# EAGLE design eb-1 (EAGLE 7.7.0)

## Sheet 1 of 2
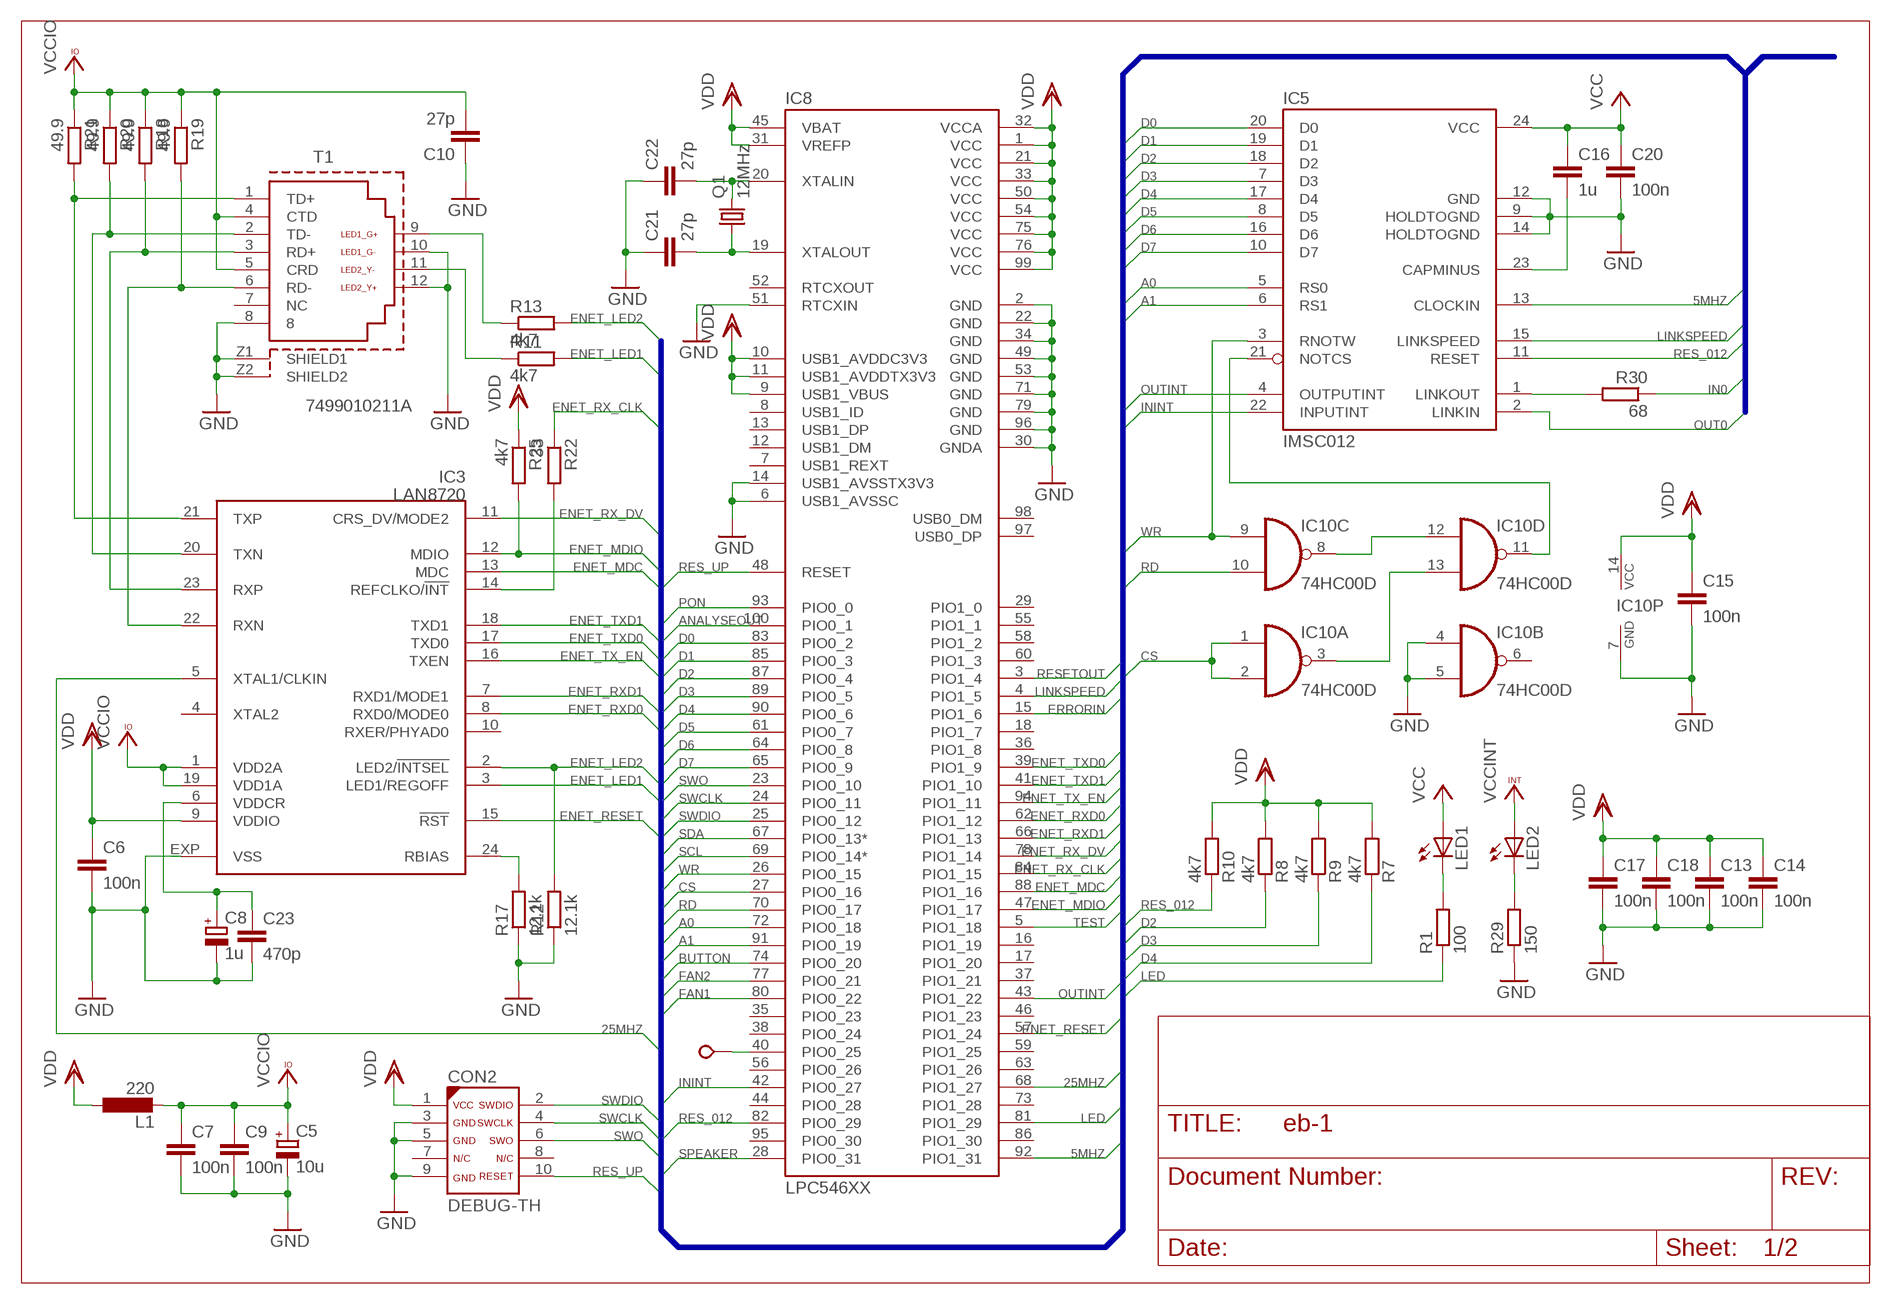
[diagram p0: schematic, sheet 1]

### Parts
C5  10u  CPOL-EUCT3216  [CT3216]
C6  100n  C-EUC1206  [C1206]
C7  100n  C-EUC1206  [C1206]
C8  1u  CPOL-EUCT3216  [CT3216]
C9  100n  C-EUC1206  [C1206]
C10  27p  C-EUC1206  [C1206]
C13  100n  C-EUC1206  [C1206]
C14  100n  C-EUC1206  [C1206]
C15  100n  C-EUC1206  [C1206]
C16  1u  C-EUC1206  [C1206]
C17  100n  C-EUC1206  [C1206]
C18  100n  C-EUC1206  [C1206]
C20  100n  C-EUC1206  [C1206]
C21  27p  C-EUC1206  [C1206]
C22  27p  C-EUC1206  [C1206]
C23  470p  C-EUC1206  [C1206]
CON2  DEBUG-TH  [DEBUG-TH]
IC3  LAN8720  [QFN24]
IC5  IMSC012  [DIL24-3]
IC8  LPC546XX  [LQFP100]
IC10  74HC00D  [SO14]
L1  220  L-EUL3216C  [L3216C]
LED1  LEDSMT1206  [1206]
LED2  LEDSMT1206  [1206]
Q1  12MHz  CRYSTALHC49UP  [HC49UP]
R1  100  R-EU_R1206  [R1206]
R7  4k7  R-EU_R1206  [R1206]
R8  4k7  R-EU_R1206  [R1206]
R9  4k7  R-EU_R1206  [R1206]
R10  4k7  R-EU_R1206  [R1206]
R11  4k7  R-EU_R1206  [R1206]
R12  12.1k  R-EU_R1206  [R1206]
R13  4k7  R-EU_R1206  [R1206]
R17  12.1k  R-EU_R1206  [R1206]
R18  49.9  R-EU_R1206  [R1206]
R19  49.9  R-EU_R1206  [R1206]
R20  49.9  R-EU_R1206  [R1206]
R21  49.9  R-EU_R1206  [R1206]
R22  33  R-EU_R1206  [R1206]
R25  4k7  R-EU_R1206  [R1206]
R29  150  R-EU_R1206  [R1206]
R30  68  R-EU_R1206  [R1206]
T1  7499010211A  WE-RJ45_7499010211A  [7499010211A]
TP2  TESTPOINT  [VERO_TP]

### Nets
5MHZ: IC5.13(CLOCKIN) IC8.92(PIO1_31)
25MHZ: IC3.5(XTAL1/CLKIN) IC8.68(PIO1_27)
A0: IC5.5(RS0) IC8.72(PIO0_18)
A1: IC5.6(RS1) IC8.91(PIO0_19)
ANALYSEOUT: IC8.100(PIO0_1) ; also sheet 2
BUTTON: IC8.74(PIO0_20) ; also sheet 2
CS: IC8.27(PIO0_16) IC10.1(A:I0) IC10.2(A:I1)
D0: IC5.20(D0) IC8.83(PIO0_2)
D1: IC5.19(D1) IC8.85(PIO0_3)
D2: IC5.18(D2) IC8.87(PIO0_4) R8.1
D3: IC5.7(D3) IC8.89(PIO0_5) R9.1
D4: IC5.17(D4) IC8.90(PIO0_6) R7.1
D5: IC5.8(D5) IC8.61(PIO0_7)
D6: IC5.16(D6) IC8.64(PIO0_8)
D7: IC5.10(D7) IC8.65(PIO0_9)
ENET_LED1: IC3.3(LED1/REGOFF) R11.2
ENET_LED2: IC3.2(LED2/!INTSEL) R12.2 R13.2
ENET_MDC: IC3.13(MDC) IC8.88(PIO1_16)
ENET_MDIO: IC3.12(MDIO) IC8.47(PIO1_17) R25.2
ENET_RESET: IC3.15(!RST) IC8.57(PIO1_24)
ENET_RX_CLK: IC8.84(PIO1_15) R22.1
ENET_RX_DV: IC3.11(CRS_DV/MODE2) IC8.78(PIO1_14)
ENET_RXD0: IC3.8(RXD0/MODE0) IC8.62(PIO1_12)
ENET_RXD1: IC3.7(RXD1/MODE1) IC8.66(PIO1_13)
ENET_TX_EN: IC3.16(TXEN) IC8.94(PIO1_11)
ENET_TXD0: IC3.17(TXD0) IC8.39(PIO1_9)
ENET_TXD1: IC3.18(TXD1) IC8.41(PIO1_10)
ERRORIN: IC8.15(PIO1_6) ; also sheet 2
FAN1: IC8.80(PIO0_22) ; also sheet 2
FAN2: IC8.77(PIO0_21) ; also sheet 2
GND: C5.- C6.2 C7.2 C8.- C9.2 C10.1 C13.2 C14.2 C15.2 C17.2 C18.2 C20.2 C21.1 C22.1 C23.2 CON2.3 CON2.5 CON2.9 IC3.EXP(VSS) IC5.9(HOLDTOGND) IC5.12(GND) IC5.14(HOLDTOGND) IC8.2(GND) IC8.6(USB1_AVSSC) IC8.14(USB1_AVSSTX3V3) IC8.22(GND) IC8.30(GNDA) IC8.34(GND) IC8.49(GND) IC8.51(RTCXIN) IC8.53(GND) IC8.71(GND) IC8.79(GND) IC8.96(GND) IC10.4(B:I0) IC10.5(B:I1) IC10.7(P:GND) R12.1 R17.1 R29.1 T1.8 T1.10(LED1_G-) T1.12(LED2_Y+) T1.Z1(SHIELD1) T1.Z2(SHIELD2) ; also sheet 2
IN0: R30.1 ; also sheet 2
ININT: IC5.22(INPUTINT) IC8.42(PIO0_27)
LED: IC8.81(PIO1_29) R1.1
LINKSPEED: IC5.15(LINKSPEED) IC8.4(PIO1_5) ; also sheet 2
N$1: IC3.14(REFCLKO/!INT) R22.2
N$6: R13.1 T1.9(LED1_G+)
N$7: IC3.24(RBIAS) R17.2
N$8: R11.1 T1.11(LED2_Y-)
N$9: IC8.40(PIO0_25) TP2.P$1
N$15: C8.+ C23.1 IC3.6(VDDCR)
N$35: C22.2 IC8.20(XTALIN) Q1.2
N$36: C21.2 IC8.19(XTALOUT) Q1.1
N$44: IC5.1(LINKOUT) R30.2
N$57: IC5.21(NOTCS) IC10.11(D:O)
N$60: C16.2 IC5.23(CAPMINUS)
N$63: LED2.C R29.2
N$65: LED1.C R1.2
N$66: IC10.8(C:O) IC10.12(D:I0)
N$68: IC10.3(A:O) IC10.13(D:I1)
OUT0: IC5.2(LINKIN) ; also sheet 2
OUTINT: IC5.4(OUTPUTINT) IC8.43(PIO1_22)
PON: IC8.93(PIO0_0) ; also sheet 2
RD: IC8.70(PIO0_17) IC10.10(C:I1)
RES_012: IC5.11(RESET) IC8.82(PIO0_29) R10.1
RES_UP: CON2.10 IC8.48(RESET)
RESETOUT: IC8.3(PIO1_4) ; also sheet 2
RX_N: IC3.22(RXN) R19.2 T1.6(RD-)
RX_P: IC3.23(RXP) R18.2 T1.3(RD+)
SCL: IC8.69(PIO0_14*) ; also sheet 2
SDA: IC8.67(PIO0_13*) ; also sheet 2
SPEAKER: IC8.28(PIO0_31) ; also sheet 2
SWCLK: CON2.4 IC8.24(PIO0_11)
SWDIO: CON2.2 IC8.25(PIO0_12)
SWO: CON2.6 IC8.23(PIO0_10)
TEST: IC8.5(PIO1_18) ; also sheet 2
TX_N: IC3.20(TXN) R20.2 T1.2(TD-)
TX_P: IC3.21(TXP) R21.2 T1.1(TD+)
VCC: C16.1 C20.1 IC5.24(VCC) LED1.A ; also sheet 2
VCCINT: LED2.A ; also sheet 2
VCCIO: C5.+ C7.1 C9.1 C10.2 IC3.1(VDD2A) IC3.19(VDD1A) L1.2 R18.1 R19.1 R20.1 R21.1 T1.4(CTD) T1.5(CRD)
VDD: C6.1 C13.1 C14.1 C15.1 C17.1 C18.1 CON2.1 IC3.9(VDDIO) IC8.1(VCC) IC8.9(USB1_VBUS) IC8.10(USB1_AVDDC3V3) IC8.11(USB1_AVDDTX3V3) IC8.21(VCC) IC8.31(VREFP) IC8.32(VCCA) IC8.33(VCC) IC8.45(VBAT) IC8.50(VCC) IC8.54(VCC) IC8.75(VCC) IC8.76(VCC) IC8.99(VCC) IC10.14(P:VCC) L1.1 R7.2 R8.2 R9.2 R10.2 R25.1 ; also sheet 2
WR: IC5.3(RNOTW) IC8.26(PIO0_15) IC10.9(C:I0)
Unconnected: CON2.7 CON2.8 IC3.4(XTAL2) IC3.10(RXER/PHYAD0) IC8.7(USB1_REXT) IC8.8(USB1_ID) IC8.12(USB1_DM) IC8.13(USB1_DP) IC8.16(PIO1_19) IC8.17(PIO1_20) IC8.18(PIO1_7) IC8.29(PIO1_0) IC8.35(PIO0_23) IC8.36(PIO1_8) IC8.37(PIO1_21) IC8.38(PIO0_24) IC8.44(PIO0_28) IC8.46(PIO1_23) IC8.52(RTCXOUT) IC8.55(PIO1_1) IC8.56(PIO0_26) IC8.58(PIO1_2) IC8.59(PIO1_25) IC8.60(PIO1_3) IC8.63(PIO1_26) IC8.73(PIO1_28) IC8.86(PIO1_30) IC8.95(PIO0_30) IC8.97(USB0_DP) IC8.98(USB0_DM) IC10.6(B:O) T1.7(NC)

### Buses
IN[0..1],OUT[0..1],ERROROUT,ERRORIN,ANALYSEIN,ANALYSEOUT,RESETIN,RESETOUT,PON,LINKSPEED,TEST,FAN[1..2],VUSB,SPEAKER,SDA,SCL,BUTTON,LED,5MHZ,SWDIO,SWCLK,SWO,RES_UP,D[0..7],A[0..1],WR,RD,CS,OUTINT,ININT,RES_012

## Sheet 2 of 2
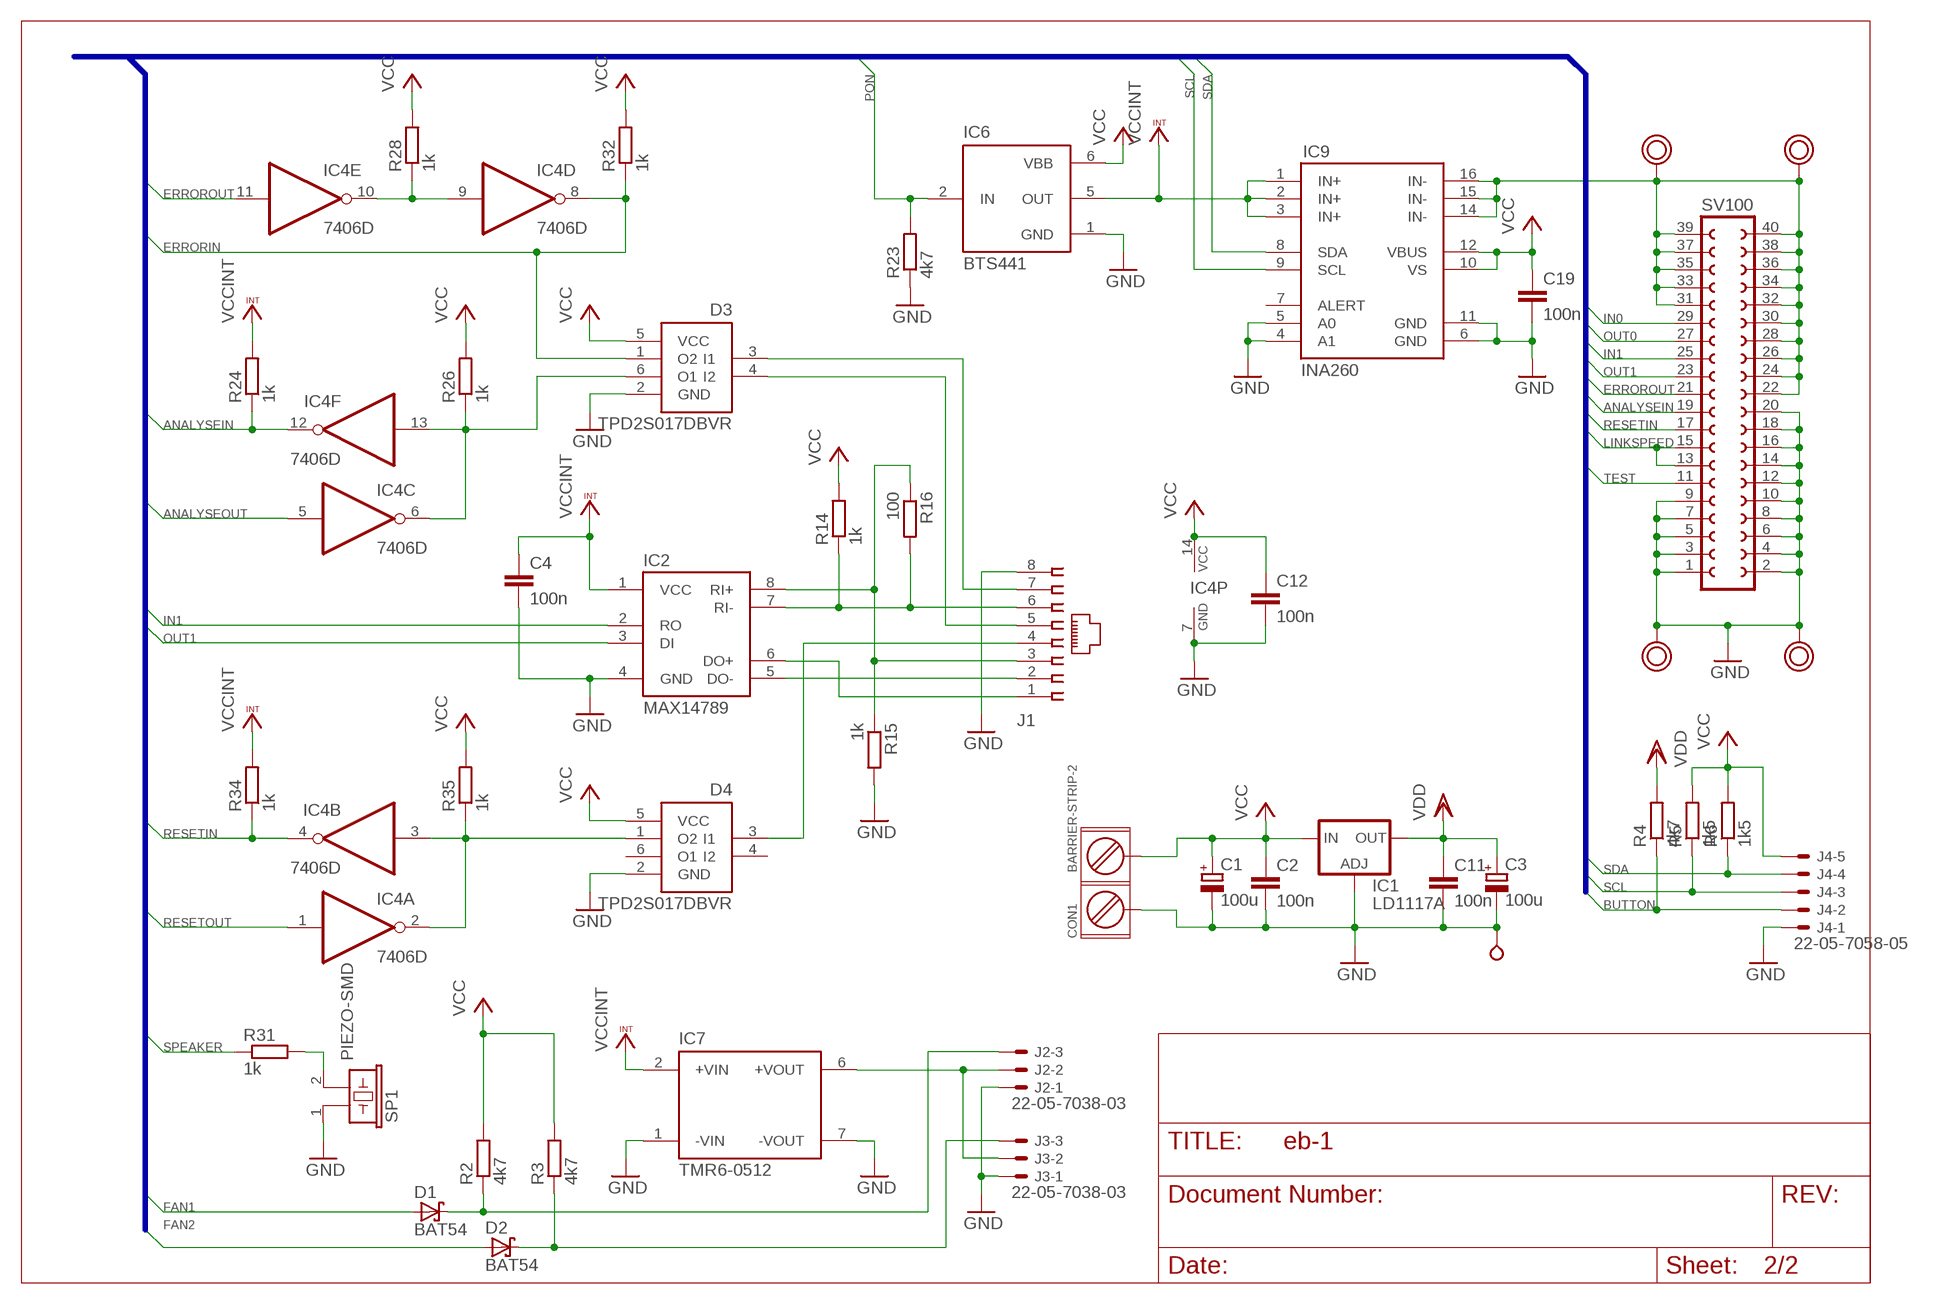
[diagram p1: schematic, sheet 2]

### Parts
C1  100u  CPOL-EUSMCB  [SMC_B]
C2  100n  C-EUC1206  [C1206]
C3  100u  CPOL-EUSMCB  [SMC_B]
C4  100n  C-EUC1206  [C1206]
C11  100n  C-EUC1206  [C1206]
C12  100n  C-EUC1206  [C1206]
C19  100n  C-EUC1206  [C1206]
CON1  BARRIER-STRIP-2  [BARRIER-STRIP-2]
D1  BAT54  [SOT23]
D2  BAT54  [SOT23]
D3  TPD2S017DBVR  [SOT23-6]
D4  TPD2S017DBVR  [SOT23-6]
IC1  LD1117A  [SOT223]
IC2  MAX14789  DS8921  [SO8]
IC4  7406D  [SO14]
IC6  BTS441  [TO263-4]
IC7  TMR6-0512  [TMR6-0512]
IC9  INA260  [TSSOP-16]
J1  555164-1  [555164-1]
J2  22-05-7038-03  [7395-03]
J3  22-05-7038-03  [7395-03]
J4  22-05-7058-05  [7395-05]
R2  4k7  R-EU_R1206  [R1206]
R3  4k7  R-EU_R1206  [R1206]
R4  4k7  R-EU_R1206  [R1206]
R5  1k5  R-EU_R1206  [R1206]
R6  1k5  R-EU_R1206  [R1206]
R14  1k  R-EU_R1206  [R1206]
R15  1k  R-EU_R1206  [R1206]
R16  100  R-EU_R1206  [R1206]
R23  4k7  R-EU_R1206  [R1206]
R24  1k  R-EU_R1206  [R1206]
R26  1k  R-EU_R1206  [R1206]
R28  1k  R-EU_R1206  [R1206]
R31  1k  R-EU_R1206  [R1206]
R32  1k  R-EU_R1206  [R1206]
R34  1k  R-EU_R1206  [R1206]
R35  1k  R-EU_R1206  [R1206]
SCREW1  POWERPAD  [POWERPAD]
SCREW2  POWERPAD  [POWERPAD]
SCREW3  POWERPAD  [POWERPAD]
SCREW4  POWERPAD  [POWERPAD]
SP1  PIEZO-SMD  [PIEZO-SMD]
SV100  FE20-2  [FE20-2]
TP1  TESTPOINT  [VERO_TP]

### Nets
ANALYSEIN: IC4.12(F:O) R24.1 SV100.19
ANALYSEOUT: IC4.5(C:I) ; also sheet 1
BUTTON: J4.2 R4.1 ; also sheet 1
ERRORIN: D3.1(O2) IC4.8(D:O) R32.1 ; also sheet 1
ERROROUT: IC4.11(E:I) SV100.21
FAN1: D1.1(A) ; also sheet 1
FAN2: D2.1(A) ; also sheet 1
GND: C1.- C2.2 C3.- C4.2 C11.2 C12.2 C19.2 CON1.1 D3.2(GND) D4.2(GND) IC1.1(ADJ) IC2.4(GND) IC4.7(P:GND) IC6.1(GND) IC7.1(-VIN) IC7.7(-VOUT) IC9.4(A1) IC9.5(A0) IC9.6(GND) IC9.11(GND) J1.8 J2.1 J3.1 J4.1 R15.2 R23.1 SCREW2.P$1 SCREW4.P$1 SP1.1 SV100.1 SV100.2 SV100.3 SV100.4 SV100.5 SV100.6 SV100.7 SV100.8 SV100.9 SV100.10 SV100.12 SV100.14 SV100.16 SV100.18 SV100.20 TP1.P$1 ; also sheet 1
IN0: SV100.29 ; also sheet 1
IN1: IC2.2(RO) SV100.25
LINKSPEED: SV100.13 SV100.15 ; also sheet 1
N$2: D4.1(O2) IC4.2(A:O) IC4.3(B:I) R35.1
N$3: IC4.9(D:I) IC4.10(E:O) R28.1
N$5: IC2.6(DO+) J1.1
N$10: IC2.5(DO-) J1.2
N$11: D3.3(I1) J1.7
N$12: D4.3(I1) J1.4
N$13: D3.4(I2) J1.5
N$14: D3.6(O1) IC4.6(C:O) IC4.13(F:I) R26.1
N$21: IC2.8(RI+) J1.3 R15.1 R16.1
N$22: IC2.7(RI-) J1.6 R14.1 R16.2
N$33: D2.3(C) J3.3 R3.1
N$40: IC9.14(IN-) IC9.15(IN-) IC9.16(IN-) SCREW1.P$1 SCREW3.P$1 SV100.22 SV100.24 SV100.26 SV100.28 SV100.30 SV100.31 SV100.32 SV100.33 SV100.34 SV100.35 SV100.36 SV100.37 SV100.38 SV100.39 SV100.40
N$59: D1.3(C) J2.3 R2.1
N$64: R31.2 SP1.2
N$67: IC7.6(+VOUT) J2.2 J3.2
OUT0: SV100.27 ; also sheet 1
OUT1: IC2.3(DI) SV100.23
PON: IC6.2(IN) R23.2 ; also sheet 1
RESETIN: IC4.4(B:O) R34.1 SV100.17
RESETOUT: IC4.1(A:I) ; also sheet 1
SCL: IC9.9(SCL) J4.4 R6.1 ; also sheet 1
SDA: IC9.8(SDA) J4.3 R5.1 ; also sheet 1
SPEAKER: R31.1 ; also sheet 1
TEST: SV100.11 ; also sheet 1
VCC: C1.+ C2.1 C12.1 C19.1 CON1.2 D3.5(VCC) D4.5(VCC) IC1.3(IN) IC4.14(P:VCC) IC6.6(VBB) IC9.10(VS) IC9.12(VBUS) J4.5 R2.2 R3.2 R5.2 R6.2 R14.2 R26.2 R28.2 R32.2 R35.2 ; also sheet 1
VCCINT: C4.1 IC2.1(VCC) IC6.5(OUT) IC7.2(+VIN) IC9.1(IN+) IC9.2(IN+) IC9.3(IN+) R24.2 R34.2 ; also sheet 1
VDD: C3.+ C11.1 IC1.2(OUT) R4.2 ; also sheet 1
Unconnected: D4.4(I2) D4.6(O1) IC9.7(ALERT)

### Buses
IN[0..1],OUT[0..1],ERROROUT,ERRORIN,ANALYSEIN,ANALYSEOUT,RESETIN,RESETOUT,PON,LINKSPEED,TEST,FAN[1..2],VUSB,SPEAKER,SDA,SCL,BUTTON,LED,5MHZ,SWDIO,SWCLK,SWO,RES_UP,D[0..7],A[0..1],WR,RD,CS,OUTINT,ININT,RES_012

## Library data of the parts
C1 C3 = rcl:CPOL-EU: POLARIZED CAPACITOR, European symbol; DIGIKEY: 478-5801-1-ND
C2 C4 C6 C7 C9-C15 C17-C23 = rcl:C-EU: CAPACITOR, European symbol; DIGIKEY: 478-10855-1-ND
C5 C8 = rcl:CPOL-EU: POLARIZED CAPACITOR, European symbol
C16 = rcl:C-EU: CAPACITOR, European symbol; DIGIKEY: 478-1567-1-ND
CON1 = Transputer:BARRIER-STRIP-2; DIGIKEY: WM13929-ND
CON2 = Transputer:DEBUG; DIGIKEY: 1175-1627-ND
D1 D2 = diode:BAT54: Schottky Diodes Source: Fairchild .. BAT54.pdf; DIGIKEY: BAT54FSCT-ND
D3 D4 = Transputer:TPD2S017DBVR
IC1 = Transputer:LD1117A; DIGIKEY: 497-1228-1-ND
IC2 = Transputer:DS8921; DIGIKEY: MAX14789EGSA+-ND
IC3 = microchip-smsc-lan8720:LAN8720: LAN8720A/LAN8720Ai Small Footprint RMII 10/100 Ethernet PHY Transceiver with HP Auto-MDIX Support from SMSC / Microchip <http://www.microchip.com>. (C) 2014 Tomasz Boleslaw CEDRO, cederom@tlen.pl, http://www.tomek.cedro.info. Version 0.1 (2014-01-04): Initial release.
IC4 = 74xx-eu:74*06: Hex INVERTER, open collector high-voltage output
IC5 = Transputer:IMSC012
IC6 = Transputer:BTS441; DIGIKEY: BTS441TGATMA1CT-ND
IC7 = Transputer:TMR6-0512; DIGIKEY: 1951-2391-ND
IC8 = Transputer:LPC546XX
IC9 = Transputer:INA260; DIGIKEY: 296-47777-1-ND
IC10 = 74xx-eu:74*00: Quad 2-input NAND gate
J1 = con-amp:555164-1: AMP connector; DIGIKEY: A31442-ND
J2 J3 = con-molex:22-?-03: CONNECTOR wire to board 2.54 mm (.1 inch) pitch header; DIGIKEY: WM2785-ND; OC_FARNELL: unknown; OC_NEWARK: unknown
J4 = con-molex:22-?-05: CONNECTOR wire to board 2.54 mm (.1 inch) pitch header; DIGIKEY: WM2787-ND; OC_FARNELL: unknown; OC_NEWARK: unknown
L1 = rcl:L-EU: INDUCTOR, European symbol
LED1 LED2 = led:LED: LED OSRAM: - CHIPLED LG R971, LG N971, LY N971, LG Q971, LY Q971, LO R971, LY R971 LH N974, LH R974 LS Q976, LO Q976, LY Q976 LO Q996 - Hyper CHIPLED LW Q18S LB Q993, LB Q99A, LB R99A - SideLED LS A670, LO A670, LY A670, LG A670, LP A670 LB A673, LV A673, LT A673, LW A673 LH A674 LY A675 LS A676, LA A676, LO A676, LY A676, LW A676 LS A679, LY A679, LG A679 - Hyper Micro SIDELED® LS Y876, LA Y876, LO Y876, LY Y876 LT Y87S - SmartLED LW L88C, LW L88S LB L89C, LB L89S, LG L890 LS L89K, LO L89K, LY L89K LS L896, LA L896, LO L896, LY L896 - TOPLED LS T670, LO T670, LY T670, LG T670, LP T670 LSG T670, LSP T670, LSY T670, LOP T670, LYG T670 LG T671, LOG T671, LSG T671 LB T673, LV T673, LT T673, LW T673 LH T674 LS T676, LA T676, LO T676, LY T676, LB T676, LH T676, LSB T676, LW T676 LB T67C, LV T67C, LT T67C, LS T67K, LO T67K, LY T67K, LW E67C LS E67B, LA E67B, LO E67B, LY E67B, LB E67C, LV E67C, LT E67C LW T67C LS T679, LY T679, LG T679 LS T770, LO T770, LY T770, LG T770, LP T770 LB T773, LV T773, LT T773, LW T773 LH T774 LS E675, LA E675, LY E675, LS T675 LS T776, LA T776, LO T776, LY T776, LB T776 LHGB T686 LT T68C, LB T68C - Hyper Mini TOPLED® LB M676 - Mini TOPLED Santana® LG M470 LS M47K, LO M47K, LY M47K Source: http://www.osram.convergy.de LUXEON: - LUMILED® LXK2-PW12-R00, LXK2-PW12-S00, LXK2-PW14-U00, LXK2-PW14-V00 LXK2-PM12-R00, LXK2-PM12-S00, LXK2-PM14-U00 LXK2-PE12-Q00, LXK2-PE12-R00, LXK2-PE12-S00, LXK2-PE14-T00, LXK2-PE14-U00 LXK2-PB12-K00, LXK2-PB12-L00, LXK2-PB12-M00, LXK2-PB14-N00, LXK2-PB14-P00, LXK2-PB14-Q00 LXK2-PR12-L00, LXK2-PR12-M00, LXK2-PR14-Q00, LXK2-PR14-R00 LXK2-PD12-Q00, LXK2-PD12-R00, LXK2-PD12-S00 LXK2-PH12-R00, LXK2-PH12-S00 LXK2-PL12-P00, LXK2-PL12-Q00, LXK2-PL12-R00 Source: www.luxeon.com KINGBRIGHT: KA-3528ASYC Source: www.kingbright.com; DIGIKEY: 160-1404-1-ND
Q1 = crystal:CRYSTAL: CRYSTAL; OC_FARNELL: unknown; OC_NEWARK: unknown
R1 R16 = rcl:R-EU_: RESISTOR, European symbol; DIGIKEY: CR1206-FX-1000ELFCT-ND
R2-R4 R7-R13 R17-R23 R25 = rcl:R-EU_: RESISTOR, European symbol; DIGIKEY: CR1206-FX-4701ELFCT-ND
R5 R6 = rcl:R-EU_: RESISTOR, European symbol; DIGIKEY: CR1206-FX-1501ELFCT-ND
R14 R15 R24 R26 R28 R31 R32 R34 R35 = rcl:R-EU_: RESISTOR, European symbol; DIGIKEY: CR1206-FX-1001ELFCT-ND
R29 = rcl:R-EU_: RESISTOR, European symbol; DIGIKEY: CR1206-FX-1500ELFCT-ND
R30 = rcl:R-EU_: RESISTOR, European symbol; DIGIKEY: CR1206-FX-68R0ELFCT-ND
SCREW1-SCREW4 = Transputer:POWERPAD
SP1 = Transputer:PIEZO-SMD; DIGIKEY: 490-9647-1-ND
SV100 = con-lsta:FE20-2: FEMALE HEADER; OC_FARNELL: unknown; OC_NEWARK: unknown
T1 = o160650v244+Eagle_WE-RJ45+(rev20e):WE-RJ45_7499010211A: WE-RJ45 LAN Transformer Characteristics RJ45 Connector with integrated transformer / common mode choke Power over Ethernet up to 50 Watt and speeds up to 10 Gbit/s Available in SMD, THT and THT with USB Compliant with standards: IEEE 802.3u, IEEE 802.3ab, IEEE 802.3af, IEEE 802.3at, IEEE 802.3an and upcoming IEE 802.3bt Applications Suitable for industrial temperatures from –40 °C up to +85 °C Compatible to Industrial Ethernet systems like EtherCAT or Profinet Compliant with most IC’s for Ethernet applications such as Microchip, Texas Instruments, Broadcom, Linear Technology Hubs, Routers, Switches, IP cameras, IoT applications <https://www.we-online.com/catalog/media/o35731v209%20Family_WE-RJ45-LAN.jpg> Details see: https://www.we-online.com/catalog/en/WE-LAN-RJ45 Updated by Ella Wu 2019-08-05 2019 (C) Wurth Elektronik; DATA-RATE: 10/100 Base-T; DATASHEET-URL: https://www.we-online.com/catalog/datasheet/7499010211A.pdf; LED: green-yellow; MOUNT: THT; PART-NUMBER: 7499010211A; POE: non-PoE; PORTS: 1; USB: No
TP1 TP2 = Transputer:TESTPOINT

## Board
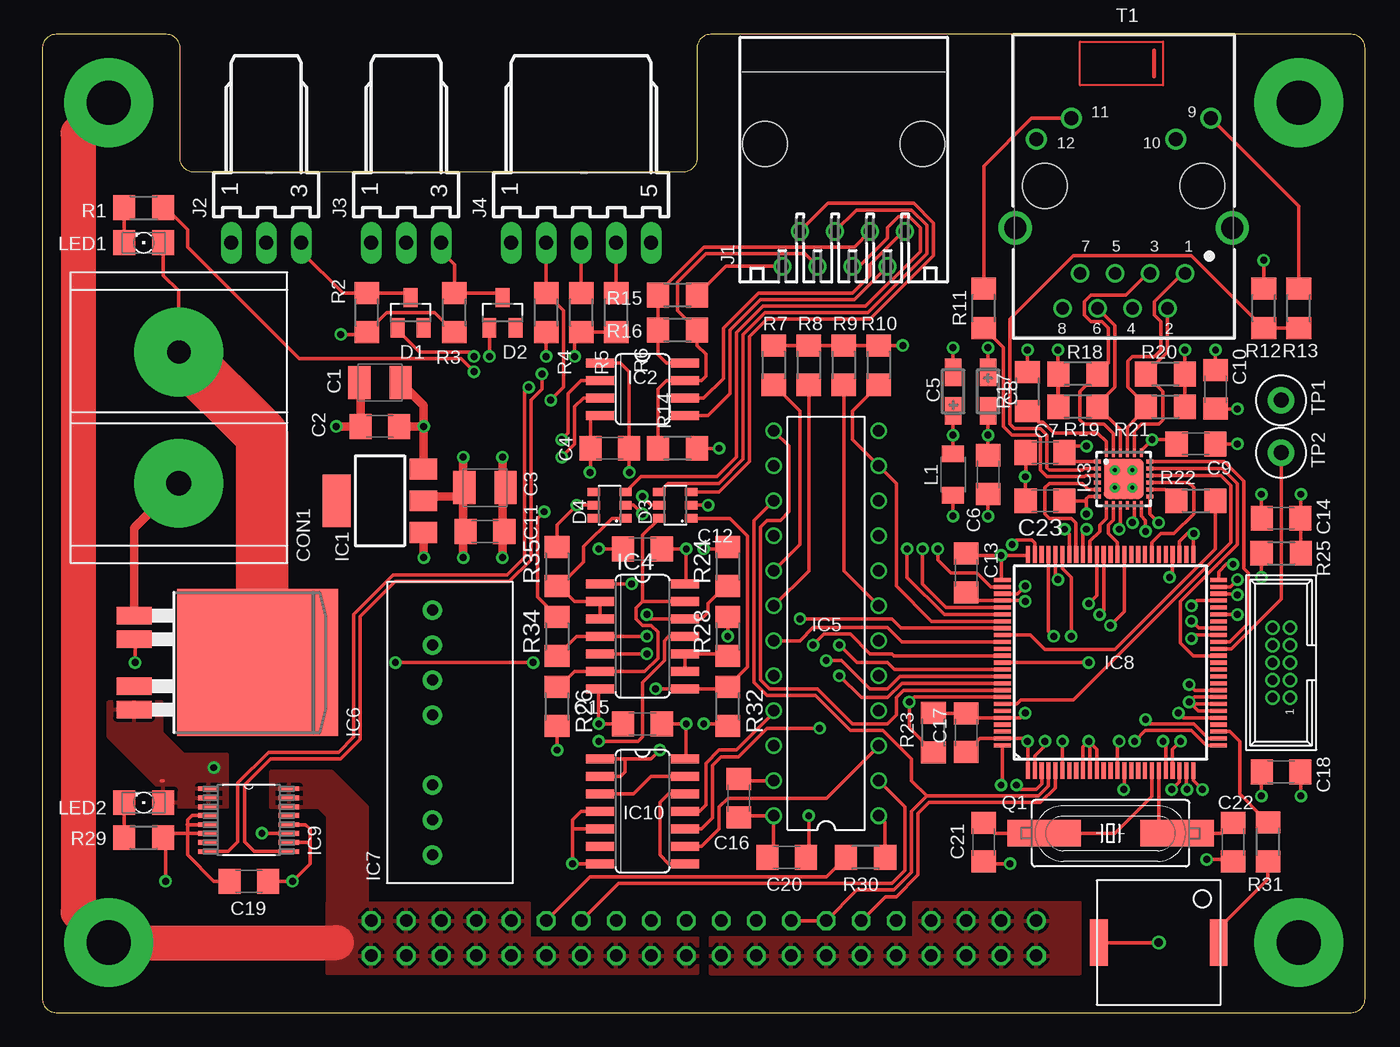
[diagram p2: board, top side]
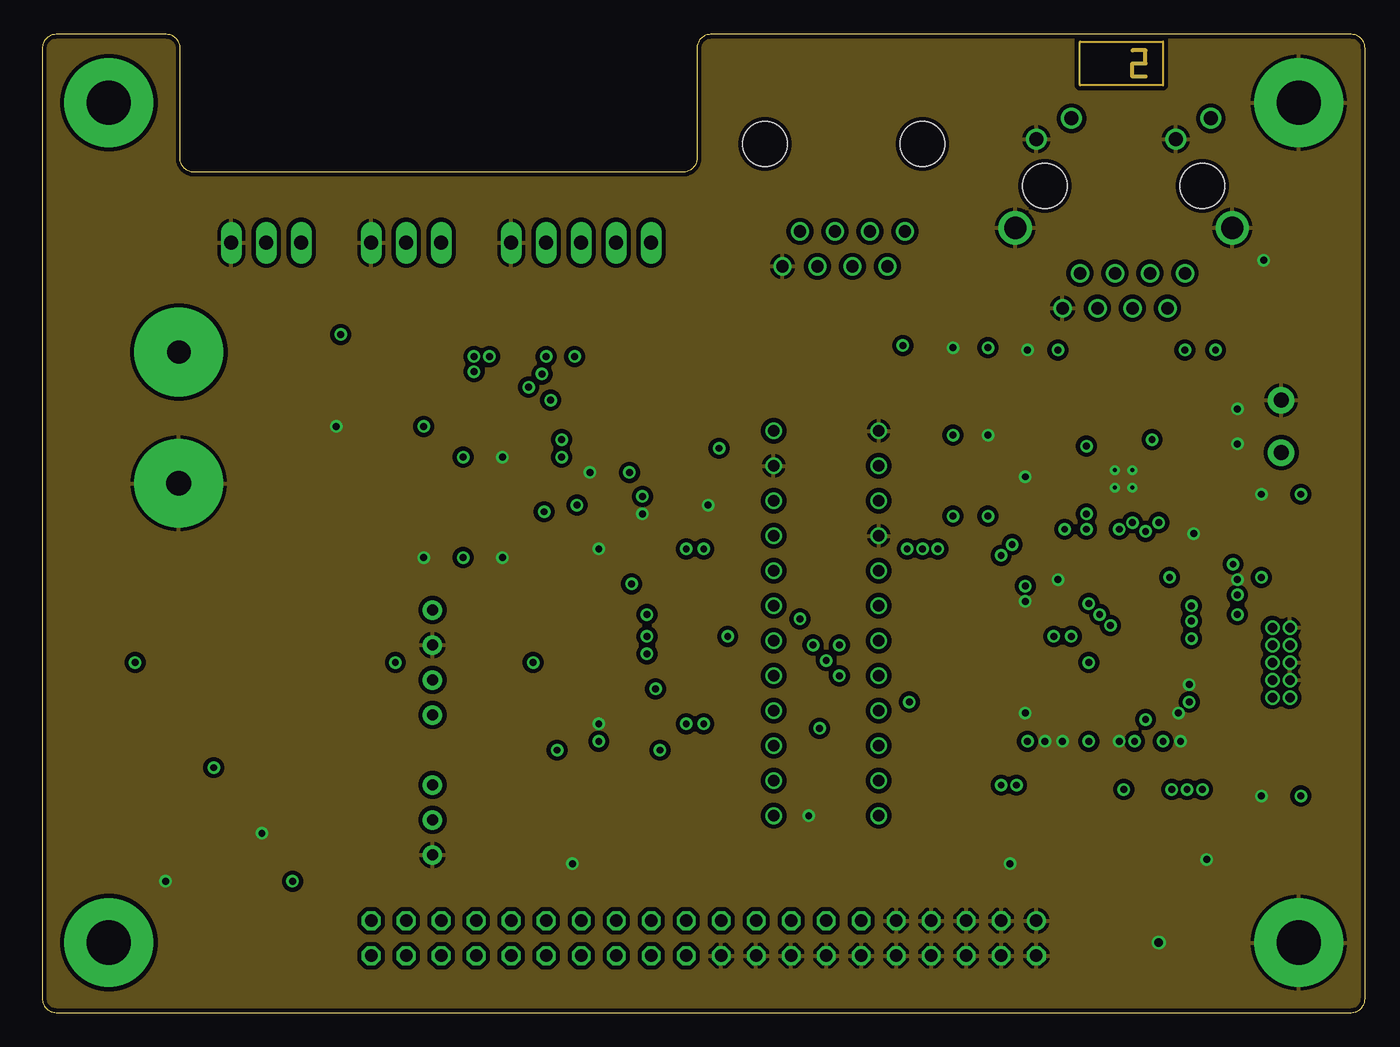
[diagram p3: board, inner layer Route2]
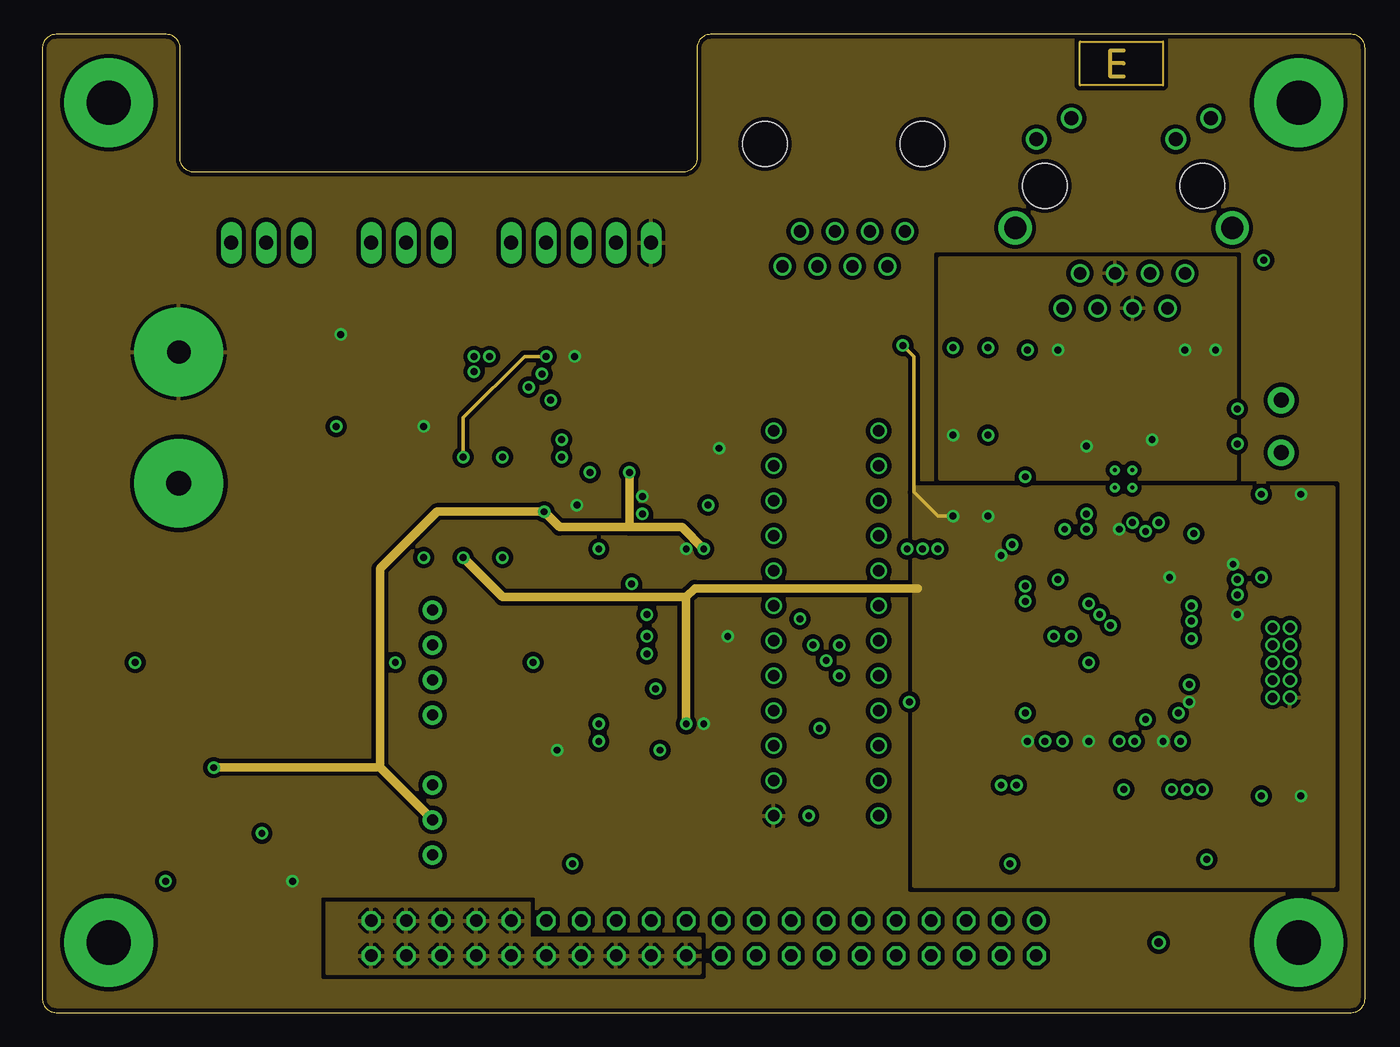
[diagram p4: board, inner layer Route15]
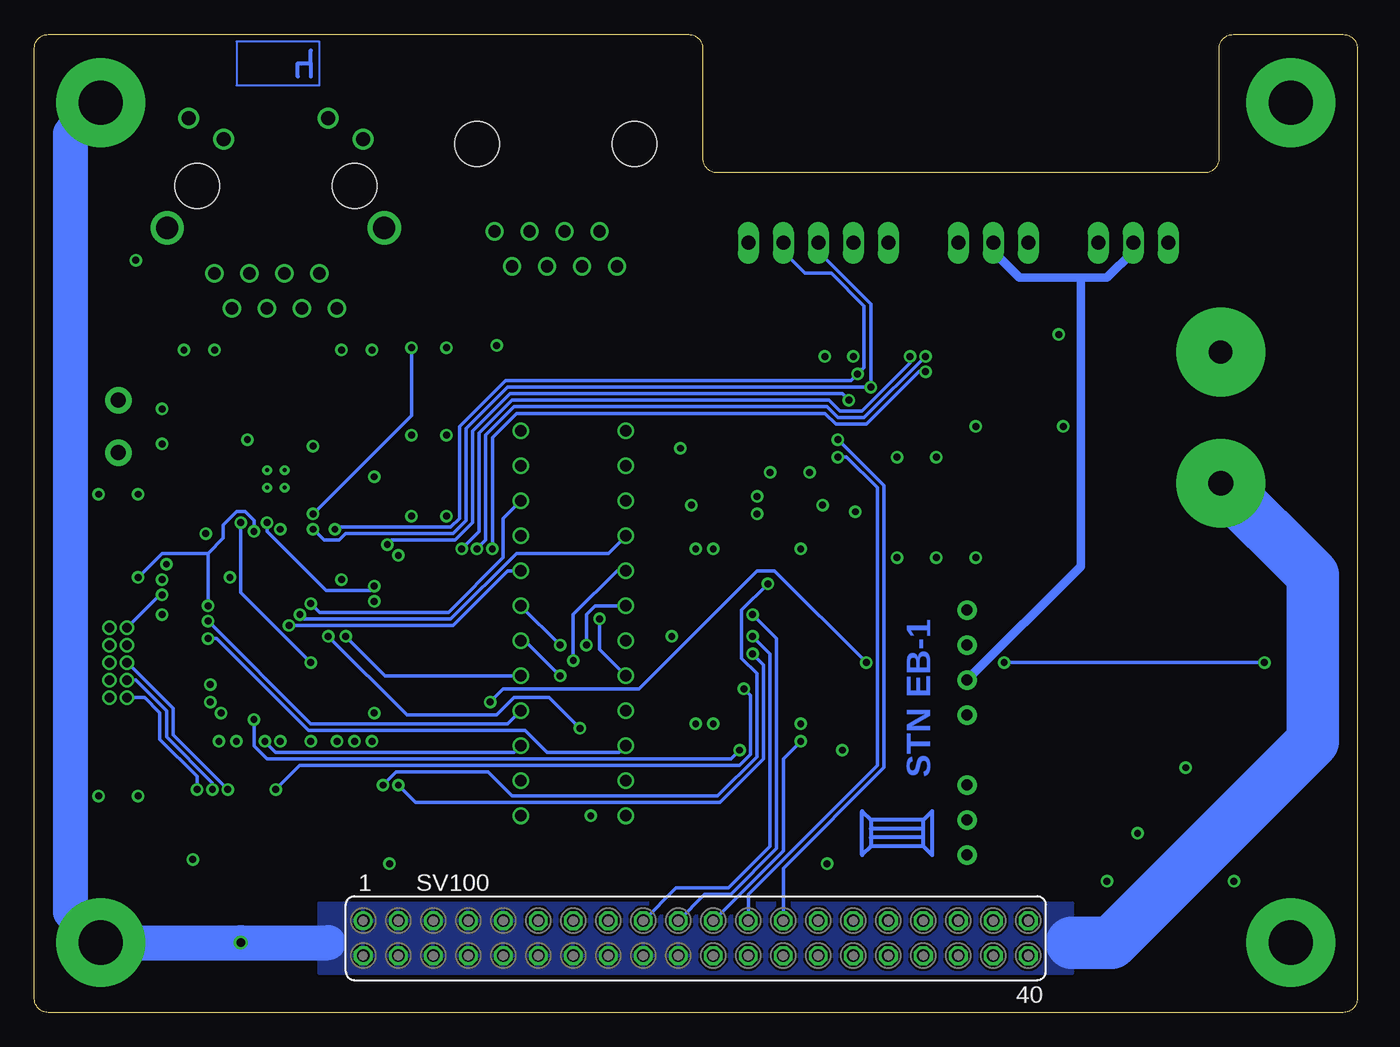
[diagram p5: board, bottom side, seen from below]

Size 96 x 71 mm. Coordinates in mm from the lower left corner, seen from the top.
Outline: 1,0 95,0 arc90 96,1 96,70 arc90 95,71 48.5,71 arc90 47.5,70 47.5,62 arc-90 46.5,61 11,61 arc-90 10,62 10,70 arc90 9,71 1,71 arc90 0,70 0,1 arc90 1,0
Copper layers (1*2*3*14*15*16): Top 0.035mm / dielectric 1.5mm / Route2 0.035mm / dielectric 0.15mm / Route3 0.035mm / dielectric 0.2mm / Route14 0.035mm / dielectric 0.15mm / Route15 0.035mm / dielectric 0.2mm / Bottom 0.035mm
Design rules "wedirect *": minimum track width 0.1mm, minimum drill 16mil, track to track 0.1mm, track to pad 0.1mm, pad to pad 0.1mm, via to via 0.1mm, smd to smd 0.1mm, copper to edge 0.25mm, drill to drill 8mil, minimum pad ring 0.1mm, minimum via ring 8mil, stop-mask expansion 4mil, vias tented up to drill 0mil, thermal gap 10mil

### Footprints (pad centres in the part's own frame; a part is rotated, then mirrored left to right if it is on the bottom)
SMC_B = smd 1.6 x 2.4: + -1.5,0; - 1.5,0
C1206 = smd 1.6 x 1.8: 1 -1.4,0; 2 1.4,0
CT3216 = smd 2 x 1.2: + -1.4,0; - 1.4,0
BARRIER-STRIP-2 = drill 1.8 pad 6.452: 1 -4.763,0 | drill 1.7 pad 6.452: 2 4.763,0
DEBUG-TH = drill 0.7 pad 1.016: 1 -2.54,-0.635; 2 -2.54,0.635; 3 -1.27,-0.635; 4 -1.27,0.635; 5 0,-0.635; 6 0,0.635; 7 1.27,-0.635; 8 1.27,0.635; 9 2.54,-0.635; 10 2.54,0.635
SOT23 = smd 1 x 1.4: 1 -0.95,-1.1; 2 0.95,-1.1; 3 0,1.1
SOT23-6 = smd 0.6 x 0.9: 1 -0.95,-1.15; 2 0,-1.15; 3 0.95,-1.15; 4 0.95,1.15; 5 0,1.15; 6 -0.95,1.15
SOT223 = smd 1.5 x 2: 1 -2.3,-3.15; 2 0,-3.15; 3 2.3,-3.15 | smd 3.8 x 2: 4 0,3.15
SO8 = smd 0.66 x 2.032: 1 -1.905,-3.073; 2 -0.635,-3.073; 3 0.635,-3.073; 4 1.905,-3.073; 5 1.905,3.073; 6 0.635,3.073; 7 -0.635,3.073; 8 -1.905,3.073
QFN24 = smd 0.6 x 0.3: 1 -1.905,1.27; 2 -1.905,0.762; 3 -1.905,0.254; 4 -1.905,-0.254; 5 -1.905,-0.762; 6 -1.905,-1.27; 13 1.905,-1.27; 14 1.905,-0.762; 15 1.905,-0.254; 16 1.905,0.254; 17 1.905,0.762; 18 1.905,1.27 | smd 0.3 x 0.6: 7 -1.27,-1.905; 8 -0.762,-1.905; 9 -0.254,-1.905; 10 0.254,-1.905; 11 0.762,-1.905; 12 1.27,-1.905; 19 1.27,1.905; 20 0.762,1.905; 21 0.254,1.905; 22 -0.254,1.905; 23 -0.762,1.905; 24 -1.27,1.905 | smd 2.9 x 2.9: EXP 0,0
SO14 = smd 0.66 x 2.032: 1 -3.81,-3.073; 2 -2.54,-3.073; 3 -1.27,-3.073; 4 0,-3.073; 5 1.27,-3.073; 6 2.54,-3.073; 7 3.81,-3.073; 8 3.81,3.073; 9 2.54,3.073; 10 1.27,3.073; 11 0,3.073; 12 -1.27,3.073; 13 -2.54,3.073; 14 -3.81,3.073
DIL24-3 = drill 0.813: 1 -12.7,-3.81; 2 -10.16,-3.81; 3 -7.62,-3.81; 4 -5.08,-3.81; 5 -2.54,-3.81; 6 0,-3.81; 7 2.54,-3.81; 8 5.08,-3.81; 9 7.62,-3.81; 10 10.16,-3.81; 11 12.7,-3.81; 12 15.24,-3.81; 13 15.24,3.81; 14 12.7,3.81; 15 10.16,3.81; 16 7.62,3.81; 17 5.08,3.81; 18 2.54,3.81; 19 0,3.81; 20 -2.54,3.81; 21 -5.08,3.81; 22 -7.62,3.81; 23 -10.16,3.81; 24 -12.7,3.81
TO263-4 = smd 1.27 x 2.54: 1 -3.404,-5.791; 2 -1.702,-5.791; 4 1.702,-5.791; 5 3.404,-5.791 | smd 10.668 x 11.684: 6 0,3.175
TMR6-0512 = drill 0.8 pad 1.422: 1 -8.89,0; 2 -6.35,0; 3 -3.81,0; 5 1.27,0; 6 3.81,0; 7 6.35,0; 8 8.89,0
LQFP100 = smd 1.2 x 0.3: 1 -7.85,6; 2 -7.85,5.5; 3 -7.85,5; 4 -7.85,4.5; 5 -7.85,4; 6 -7.85,3.5; 7 -7.85,3; 8 -7.85,2.5; 9 -7.85,2; 10 -7.85,1.5; 11 -7.85,1; 12 -7.85,0.5; 13 -7.85,0; 14 -7.85,-0.5; 15 -7.85,-1; 16 -7.85,-1.5; 17 -7.85,-2; 18 -7.85,-2.5; 19 -7.85,-3; 20 -7.85,-3.5; 21 -7.85,-4; 22 -7.85,-4.5; 23 -7.85,-5; 24 -7.85,-5.5; 25 -7.85,-6; 51 7.85,-6; 52 7.85,-5.5; 53 7.85,-5; 54 7.85,-4.5; 55 7.85,-4; 56 7.85,-3.5; 57 7.85,-3; 58 7.85,-2.5; 59 7.85,-2; 60 7.85,-1.5; 61 7.85,-1; 62 7.85,-0.5; 63 7.85,0; 64 7.85,0.5; 65 7.85,1; 66 7.85,1.5; 67 7.85,2; 68 7.85,2.5; 69 7.85,3; 70 7.85,3.5; 71 7.85,4; 72 7.85,4.5; 73 7.85,5; 74 7.85,5.5; 75 7.85,6 | smd 0.3 x 1.2: 26 -6,-7.85; 27 -5.5,-7.85; 28 -5,-7.85; 29 -4.5,-7.85; 30 -4,-7.85; 31 -3.5,-7.85; 32 -3,-7.85; 33 -2.5,-7.85; 34 -2,-7.85; 35 -1.5,-7.85; 36 -1,-7.85; 37 -0.5,-7.85; 38 0,-7.85; 39 0.5,-7.85; 40 1,-7.85; 41 1.5,-7.85; 42 2,-7.85; 43 2.5,-7.85; 44 3,-7.85; 45 3.5,-7.85; 46 4,-7.85; 47 4.5,-7.85; 48 5,-7.85; 49 5.5,-7.85; 50 6,-7.85; 76 6,7.85; 77 5.5,7.85; 78 5,7.85; 79 4.5,7.85; 80 4,7.85; 81 3.5,7.85; 82 3,7.85; 83 2.5,7.85; 84 2,7.85; 85 1.5,7.85; 86 1,7.85; 87 0.5,7.85; 88 0,7.85; 89 -0.5,7.85; 90 -1,7.85; 91 -1.5,7.85; 92 -2,7.85; 93 -2.5,7.85; 94 -3,7.85; 95 -3.5,7.85; 96 -4,7.85; 97 -4.5,7.85; 98 -5,7.85; 99 -5.5,7.85; 100 -6,7.85
TSSOP-16 = smd 1.473 x 0.356: 1 -2.921,2.286; 2 -2.921,1.626; 3 -2.921,0.965; 4 -2.921,0.33; 5 -2.921,-0.33; 6 -2.921,-0.965; 7 -2.921,-1.626; 8 -2.921,-2.286; 9 2.921,-2.286; 10 2.921,-1.626; 11 2.921,-0.965; 12 2.921,-0.33; 13 2.921,0.33; 14 2.921,0.965; 15 2.921,1.626; 16 2.921,2.286
555164-1 = drill 0.889: 1 -4.445,5.207; 2 -3.175,7.747; 3 -1.905,5.207; 4 -0.635,7.747; 5 0.635,5.207; 6 1.905,7.747; 7 3.175,5.207; 8 4.445,7.747 | hole 3.251: -5.715,-1.143; 5.715,-1.143
7395-03 = drill 1.016 long: 1 2.54,0; 2 0,0; 3 -2.54,0
7395-05 = drill 1.016 long: 1 5.08,0; 2 2.54,0; 3 0,0; 4 -2.54,0; 5 -5.08,0
L3216C = smd 1.2 x 1.6: 1 -1.5,0; 2 1.5,0
1206 = smd 1.6 x 1.803: A -1.422,0; C 1.422,0
HC49UP = smd 5.334 x 1.93: 1 -4.826,0; 2 4.826,0
R1206 = smd 1.6 x 1.803: 1 -1.422,0; 2 1.422,0
POWERPAD = drill 3.2 pad 6.452: P$1 0,0
PIEZO-SMD = smd 1.3 x 3.4: 1 -4.35,0; 2 4.35,0
FE20-2 = drill 0.914: 1 -24.13,1.27 | drill 0.914 octagon: 2 -24.13,-1.27; 3 -21.59,1.27; 4 -21.59,-1.27; 5 -19.05,1.27; 6 -19.05,-1.27; 7 -16.51,1.27; 8 -16.51,-1.27; 9 -13.97,1.27; 10 -13.97,-1.27; 11 -11.43,1.27; 12 -11.43,-1.27; 13 -8.89,1.27; 14 -8.89,-1.27; 15 -6.35,1.27; 16 -6.35,-1.27; 17 -3.81,1.27; 18 -3.81,-1.27; 19 -1.27,1.27; 20 -1.27,-1.27; 21 1.27,1.27; 22 1.27,-1.27; 23 3.81,1.27; 24 3.81,-1.27; 25 6.35,1.27; 26 6.35,-1.27; 27 8.89,1.27; 28 8.89,-1.27; 29 11.43,1.27; 30 11.43,-1.27; 31 13.97,1.27; 32 13.97,-1.27; 33 16.51,1.27; 34 16.51,-1.27; 35 19.05,1.27; 36 19.05,-1.27; 37 21.59,1.27; 38 21.59,-1.27; 39 24.13,1.27; 40 24.13,-1.27
7499010211A = drill 0.9: 1 4.445,-6.35; 2 3.175,-8.89; 3 1.905,-6.35; 4 0.635,-8.89; 5 -0.635,-6.35; 6 -1.905,-8.89; 7 -3.175,-6.35; 8 -4.445,-8.89 | drill 1.02: 9 6.325,4.9; 10 3.785,3.38; 11 -3.785,4.9; 12 -6.325,3.38 | drill 1.6: Z1 7.875,-3.05; Z2 -7.875,-3.05 | hole 3.25: 5.715,0; -5.715,0
VERO_TP = drill 1.1 pad 1.93: P$1 0,0

### Placement (x,y rotation side)
C1  24.5,45.72 180 top
C2  24.5,42.55 180 top
C3  32.12,38.1 0 top
C4  41.17,40.96 180 top
C5  66.1,45.09 90 top
C6  68.64,39.05 90 top
C7  72.77,40.64 180 top
C8  68.64,45.09 270 top
C9  83.72,41.27 0 top
C10  85.15,45.24 90 top
C11  32.12,34.92 0 top
C12  43.55,33.66 180 top
C13  67.05,31.91 270 top
C14  89.91,35.88 180 top
C15  43.55,20.95 180 top
C16  50.54,15.56 90 top
C17  67.05,20.32 90 top
C18  89.91,17.46 180 top
C19  14.98,9.53 180 top
C20  54.03,11.27 0 top
C21  68.32,12.38 90 top
C22  86.42,12.38 90 top
C23  72.77,37.15 180 top
CON1  9.9,43.18 90 top
CON2  89.91,25.4 90 top
D1  26.73,50.8 0 top
D2  33.39,50.8 0 top
D3  45.94,36.83 90 top
D4  41.17,36.83 90 top
IC1  24.5,37.15 90 top
IC2  43.55,45.24 270 top
IC3  78.48,38.73 0 top
IC4  43.55,27.3 270 top
IC5  56.89,26.99 90 top
IC6  12.44,25.4 270 top
IC7  28.32,20.32 90 top
IC8  77.53,25.4 90 top
IC9  14.98,13.97 0 top
IC10  43.55,14.61 270 top
J1  58.16,61.91 180 top
J2  16.25,55.88 180 top
J3  26.41,55.88 180 top
J4  39.11,55.88 180 top
L1  66.1,39.05 90 top
LED1  7.36,55.88 180 top
LED2  7.36,15.24 180 top
Q1  77.53,13.02 0 top
R1  7.36,58.42 180 top
R2  23.55,50.8 270 top
R3  29.9,50.8 270 top
R4  36.57,50.8 270 top
R5  39.11,50.8 270 top
R6  41.65,50.8 270 top
R7  53.08,46.99 90 top
R8  55.62,46.99 90 top
R9  58.16,46.99 90 top
R10  60.7,46.99 90 top
R11  68.32,51.12 270 top
R12  88.64,51.12 270 top
R13  91.18,51.12 270 top
R14  46.09,40.96 0 top
R15  46.09,52.07 0 top
R16  46.09,49.53 0 top
R17  71.5,45.09 270 top
R18  75.15,46.35 0 top
R19  75.15,43.97 0 top
R20  81.5,46.35 180 top
R21  81.5,43.97 180 top
R22  83.72,37.15 180 top
R23  64.67,20.32 270 top
R24  49.75,32.38 90 top
R25  89.91,33.34 180 top
R26  37.36,22.23 270 top
R28  49.75,27.3 90 top
R29  7.36,12.7 180 top
R30  59.75,11.27 0 top
R31  88.96,12.38 270 top
R32  49.75,22.23 270 top
R34  37.36,27.3 90 top
R35  37.36,32.38 90 top
SCREW1  4.82,66.04 90 top
SCREW2  91.18,66.04 90 top
SCREW3  4.82,5.08 90 top
SCREW4  91.18,5.08 90 top
SP1  81.02,5.08 0 top
SV100  48,5.4 0 bottom
T1  78.48,60.01 0 top
TP1  89.91,44.45 90 top
TP2  89.91,40.64 90 top
U$1  [LAYER14]  78.48,68.9 180 top
U$100  [LOGO]  33.39,13.02 270 bottom

### Tracks (layer width: path | path; a pad name or v marks a point on that pad's centre or on a via)
5MHZ
  Top 0.254: IC8.92 62.51,23.4 61.97,22.86 61.97,21.59 61.34,20.95 58.8,20.95 56.26,23.5 52.76,23.5 52.13,24.13 52.13,35.24 52.6,35.72 53.56,35.72 54.19,36.35 54.19,41.12 IC5.13
25MHZ
  Top 0.254: IC8.68 75.03,35.52 74.67,35.88 73.08,35.88 72.77,36.2 72.77,38.1 73.08,38.42 75.46,38.42 75.91,37.97 IC3.5
A0  (via drill 0.5)
  Top 0.254: IC8.72 73.03,27.68 v73.4,27.3
  Bottom 0.254: IC5.5 70.54,24.45 v73.4,27.3
A1  (via drill 0.5)
  Top 0.254: IC8.91 62.38,23.9 61.34,22.86 59.43,22.86 v57.84,24.45
  Bottom 0.254: IC5.6 60.38,26.99 v57.84,24.45
ANALYSEIN  (via drill 0.5)
  Top 0.254: R24.1 49.59,30.96 48.32,29.69 48.32,29.05 47.84,28.57 IC4.12 44.19,28.57 v43.87,28.89
  Bottom 0.254: SV100.19 47.37,8.57 45.46,8.57 42.13,11.91 42.13,27.15 v43.87,28.89
ANALYSEOUT  (via drill 0.5)
  Top 0.254: 69.31,19.4 IC8.100 69.68,16.6 v69.59,16.51 | IC4.5 v43.87,26.04
  Bottom 0.254: v43.87,26.04 43.08,25.24 43.08,18.41 46.25,15.24 68.32,15.24 v69.59,16.51
BUTTON  (via drill 0.5)
  Top 0.254: v36.89,44.45 37.84,45.4 37.84,50.95 R4.1 J4.2 | IC8.74 72.03,34.08 71.81,34.29 70.7,34.29 v70.38,33.97
  Bottom 0.254: v36.89,44.45 37.36,44.93 61.49,44.93 64.19,42.23 64.19,35.56 65.46,34.29 70.07,34.29 v70.38,33.97
CS  (via drill 0.5)
  Top 0.254: IC10.2 41.97,17.14 42.28,17.46 42.28,18.41 | 42.28,18.41 44.19,18.41 v44.83,19.05 | IC8.27 84.62,19.9 83.56,20.95 80.38,20.95 v80.07,21.27 | IC10.1 42.28,18.41
  Bottom 0.254: v44.83,19.05 45.46,18.41 79.11,18.41 80.07,19.37 v80.07,21.27
D0  (via drill 0.5)
  Top 0.254: IC8.83 62.33,27.9 61.65,28.57 v54.98,28.57
  Bottom 0.254: IC5.20 54.98,26.35 v54.98,28.57
D1
  Top 0.254: IC8.85 62.38,26.9 61.34,27.94 55.94,27.94 54.98,26.99 IC5.19
D2  (via drill 0.5)
  Top 0.254: IC8.87 61.79,25.9 61.65,26.04 60.06,26.04 58.64,27.46 56.73,27.46 v55.94,26.67 | R8.1 55.62,32.07 IC5.18
  Bottom 0.254: v55.94,26.67 55.94,28.89 55.3,29.53 IC5.18
D3  (via drill 0.5)
  Top 0.254: IC8.89 61.84,24.9 61.34,25.4 59.11,25.4 v57.84,26.67 | R9.1 58.16,32.07 IC5.7
  Bottom 0.254: IC5.7 v57.84,26.67
D4  (via drill 0.5)
  Top 0.254: IC8.90 62.24,24.4 61.34,23.5 60.06,23.5 58,25.56 v56.89,25.56 | R7.1 54.98,43.66 54.98,33.97 IC5.17
  Bottom 0.254: v56.89,25.56 56.89,28.89 53.72,32.07 IC5.17
D5  (via drill 0.5)
  Top 0.254: IC8.61 78.53,29.1 v77.53,28.1
  Bottom 0.254: v77.53,28.1 65.62,28.1 61.65,32.07 IC5.8
D6  (via drill 0.5)
  Top 0.254: IC8.64 77.03,29.19 v76.73,28.89
  Bottom 0.254: v76.73,28.89 76.42,28.57 65.78,28.57 61.02,33.34 54.35,33.34 IC5.16
D7  (via drill 0.5)
  Top 0.254: IC8.65 76.53,30.27 v75.94,29.69
  Bottom 0.254: IC5.10 61.97,35.88 61.97,33.02 65.94,29.05 75.31,29.05 v75.94,29.69
ENET_LED1
  Top 0.254: IC3.3 75.72,38.99 75.62,38.89 72.92,38.89 72.45,39.37 72.45,41.75 72.29,41.91 70.38,41.91 69.75,42.55 69.75,48.27 R11.2
ENET_LED2
  Top 0.254: IC3.2 75.59,39.5 75.46,39.37 73.08,39.37 72.92,39.53 72.92,41.91 72.45,42.39 70.54,42.39 70.22,42.7 70.22,50.32 74.83,54.93 83.41,54.93 R12.2 R13.2
ENET_MDC  (via drill 0.5)
  Top 0.254: IC3.13 80.38,36.2 v81.02,35.56 | IC8.88 v75.94,25.4
  Bottom 0.254: v75.94,25.4 81.02,30.48 v81.02,35.56
ENET_MDIO  (via drill 0.5)
  Top 0.254: IC3.12 79.75,36.04 80.07,35.72 v80.07,34.92 | IC8.47 83.77,29.9 v83.4,29.53 | R25.2 v88.48,31.59
  Bottom 0.254: v80.07,34.92 80.07,35.72 80.7,36.35 81.34,36.35 82.29,35.4 82.29,34.45 83.4,33.34 | 83.4,33.34 v83.4,29.53 | v88.48,31.59 86.73,33.34 83.4,33.34
ENET_RESET
  Top 0.254: IC3.15 83.18,38.48 83.56,38.1 83.56,36.2 82.13,34.77 81.18,34.77 80.53,34.12 IC8.57
ENET_RX_CLK
  Top 0.254: R22.1 85.14,33.65 77.84,26.35 72.77,26.35 71.72,27.4 IC8.84
ENET_RX_DV  (via drill 0.5)
  Top 0.254: IC3.11 79.24,35.69 v79.11,35.56 | IC8.78 70.78,30.4 v71.34,30.96
  Bottom 0.254: v79.11,35.56 79.11,34.92 74.83,30.64 71.65,30.64 v71.34,30.96
ENET_RXD0
  Top 0.254: IC8.62 78.03,34.11 77.37,34.77 77.37,35.4 77.72,35.75 IC3.8
ENET_RXD1
  Top 0.254: IC8.66 76.03,34.22 76.73,34.92 76.73,35.4 77.21,35.88 IC3.7
ENET_TX_EN
  Top 0.254: IC3.16 85.53,38.99 86.26,38.26 86.26,34.13 74.83,22.7 71.02,22.7 70.72,22.4 IC8.94
ENET_TXD0
  Top 0.254: IC3.17 85.66,39.5 86.73,38.42 86.73,33.97 82.61,29.84 82.61,26.83 83.54,25.9 IC8.39
ENET_TXD1
  Top 0.254: IC3.18 85.78,40.01 87.21,38.58 87.21,32.23 87.53,31.91 87.53,28.26 86.17,26.9 IC8.41
ERRORIN  (via drill 0.5)
  Top 0.254: IC8.15 78.53,16.24 v78.48,16.19 | D3.1 49.91,35.88 51.17,34.61 51.17,25.08 R32.1 49.75,23.5 IC4.8 v44.51,23.5
  Bottom 0.254: v78.48,16.19 76.73,17.94 44.83,17.94 44.03,18.73 44.03,23.02 v44.51,23.5
ERROROUT  (via drill 0.5)
  Top 0.254: IC4.11 45.46,27.3 45.14,26.99 45.14,25.56 43.55,23.97 43.55,20 43.24,19.68 v40.38,19.68
  Bottom 0.254: SV100.21 41.65,11.75 41.65,18.41 v40.38,19.68
FAN1  (via drill 0.5)
  Top 0.254: D1.1 25.77,49.53 27.36,47.94 31.01,47.94 v31.33,47.62 | IC8.80 65.59,29.4 63.88,31.11 v63.88,33.66
  Bottom 0.254: v31.33,47.62 35.78,43.18 37.68,43.18 38.48,43.97 61.18,43.97 63.24,41.91 63.24,34.29 v63.88,33.66
FAN2  (via drill 0.5)
  Top 0.254: D2.1 v32.44,47.62 | IC8.77 68.85,30.9 67.84,31.91 65.94,31.91 64.99,32.86 v64.99,33.66
  Bottom 0.254: v32.44,47.62 32.44,47.15 35.94,43.66 37.52,43.66 38.32,44.45 61.34,44.45 63.72,42.07 63.72,34.92 v64.99,33.66
GND  (via drill 0.3, 0.5, 0.6)
  Top 0.254: v8.95,9.53 8.95,12.7 R29.1 9.09,13.01 10.53,13.01 | IC9.6 10.53,13.01 | 10.53,13.01 10.53,13.65 10.53,13.97 10.87,14.3 IC9.4 | C19.2 12.44,9.53 10.53,11.43 10.53,13.01 | IC9.11 15.95,13.01 v15.93,13.02 | IC9.5 10.55,13.64 | C15.2 v40.38,20.95 40.38,23.39 IC4.7 | IC10.7 v38.48,10.79 38.48,13.34 | IC10.4 39.11,14.61 38.48,13.97 38.48,13.34 | IC10.5 38.48,13.34 | IC2.4 arc90 40.38,43.24 39.77,43.24 C4.2 39.77,39.24 v39.74,39.21 | v40.38,33.66 C12.2 | SP1.1 v81.02,5.08 | C21.1 68.51,10.79 v70.22,10.79 | C22.1 86.29,11.11 v84.51,11.11 | C20.2 55.62,11.27 v55.62,14.29 | IC8.6 74.03,19.68 v74.03,19.68 | IC8.14 78.03,19.55 v78.16,19.68 | IC8.22 82.03,19.11 v82.61,19.68 | IC8.30 82.8,21.4 v82.45,21.75 | IC8.2 72.03,18.63 72.77,19.37 v72.77,19.68 | IC8.34 83.66,23.4 v83.24,23.81 | v71.34,21.75 70.99,21.4 IC8.96 67.37,21.4 C17.2 64.69,21.72 R23.1 | v71.34,29.84 71.34,29.9 IC8.79 67.66,29.9 C13.2 | IC8.53 82.53,34.21 83.08,34.77 v83.56,34.77 83.53,34.73 IC8.51 | 88.48,17.49 C18.2 88.48,17.46 v88.48,15.72 | C14.2 88.48,35.91 v88.48,37.62 | IC8.49 86.2,30.9 v86.73,31.43 | IC8.71 73.53,31.62 v73.72,31.43 | C7.2 71.36,38.92 v71.34,38.89 71.34,37.15 | R12.1 v88.64,54.61 | R17.1 v71.5,48.1 | C9.2 v86.73,41.27 | C10.1 85.18,43.81 v86.73,43.81 | C6.2 v68.64,41.91 C8.- | C5.- v66.1,48.26 | v77.84,38.1 IC3.EXP | D4.2 42.92,36.83 v43.55,36.2 | D3.2 v48.32,36.83 | R15.2 49.61,54.17 J1.8
  Top 0.305: 10.55,13.64 10.53,13.65
  Top 0.406: C23.2 71.34,37.15
  Top 0.61: CON1.1 6.65,35.17 IC6.1 | v21.33,42.55 C2.2 23.11,45.62 C1.- | IC1.1 27.76,34.85 27.68,34.77 v27.68,33.02 | C11.2 33.39,34.8 | 33.39,34.8 v33.39,33.02 | C3.- 33.39,37.87 33.39,34.8 | v33.39,40.32 33.39,38.1
  Bottom 2.54: SCREW2.P$1 93.4,63.82 93.4,7.3 SCREW4.P$1 v81.02,5.08 74.67,5.08
  Bottom 3.81: CON1.1 3.23,31.75 3.23,19.68 17.84,5.08 20.7,5.08
  other vias: 79.11,39.37 77.84,39.37 79.11,38.1
  pour Route2 (isolate 0.305): 0.06,0 95.94,0 95.94,71.12 47.6,71.12 47.6,61.28 10.22,61.28 10.22,71.12 0.06,71.12
  pour Bottom (isolate 0.406): 20.7,7.94 20.7,2.86 75.31,2.86 75.31,7.94
  pour Top (isolate 0.406): 48.48,5.4 48.48,2.86 75.31,2.86 75.31,7.94 63.24,7.94 63.24,5.4
IN0
  Top 0.254: R30.1 56.9,9.84 39.74,9.84 SV100.29
IN1  (via drill 0.5)
  Top 0.254: IC2.2 39.11,45.88 38.16,44.93 38.16,42.07 v37.68,41.59
  Bottom 0.254: SV100.25 41.65,10.48 34.35,17.78 34.35,38.26 v37.68,41.59
ININT  (via drill 0.5)
  Top 0.254: IC8.42 83.66,27.4 v83.4,27.15
  Bottom 0.254: v83.4,27.15 82.77,27.15 76.1,20.48 60.38,20.48 58.8,18.89 53.56,18.89 IC5.22
LED  (via drill 0.5)
  Top 0.254: R1.1 8.95,58.42 10.53,56.83 10.53,55.56 18.63,47.47 30.38,47.47 v31.33,46.51 | IC8.81 65.45,28.9 62.76,31.59 v62.76,33.66
  Bottom 0.254: v31.33,46.51 31.81,46.51 35.62,42.7 37.84,42.7 38.63,43.5 61.02,43.5 62.76,41.75 v62.76,33.66
LINKSPEED
  Top 0.254: SV100.15 SV100.13 59.11,8.89 61.81,8.89 63.08,10.16 63.08,14.61 64.19,15.72 | 64.19,15.72 72.29,15.72 73.03,16.45 IC8.4 | IC5.15 51.65,35.72 51.65,23.97 52.6,23.02 56.1,23.02 58.64,20.48 61.02,20.48 63.08,18.41 63.08,16.83 64.19,15.72
N$1
  Top 0.254: IC3.14 81.47,37.97 R22.2
N$2
  Top 0.254: IC4.3 IC4.2 38.63,29.84 37.84,30.64 37.69,30.64 R35.1 37.83,31.43 38,31.43 39.27,32.7 39.27,33.81 41.34,35.88 D4.1
N$3
  Top 0.254: IC4.9 IC4.10 49.59,26.04 R28.1
N$5
  Top 0.254: IC2.6 48,44.61 49.43,46.04 49.43,49.69 51.97,52.23 58.8,52.23 60.06,53.5 60.06,54.29 62.48,56.71 J1.1
N$6
  Top 0.254: T1.9 91.18,58.53 R13.1
N$7
  Top 0.254: IC3.24 77.21,41.43 76.58,42.07 73.4,42.07 72.61,42.86 72.29,42.86 71.65,43.5 71.65,43.66 R17.2
N$8
  Top 0.254: T1.11 71.79,64.91 68.32,61.44 R11.1
N$9
  Top 0.254: IC8.40 86.31,26.4 89.91,30 TP2.P$1
N$10
  Top 0.254: J1.2 61.34,54.13 58.95,51.75 52.13,51.75 49.91,49.53 49.91,44.93 48.32,43.34 IC2.5
N$11
  Top 0.254: J1.7 57.02,58.74 63.24,58.74 64.67,57.31 64.67,54.93 60.06,50.32 52.6,50.32 51.33,49.05 51.33,40.01 49.11,37.78 D3.3
N$12
  Top 0.254: J1.4 59.3,54.17 61.34,56.2 61.34,56.99 62.13,57.78 62.92,57.78 63.72,56.99 63.72,55.24 59.75,51.28 52.29,51.28 50.38,49.37 50.38,40.32 48.95,38.89 43.44,38.89 D4.3
N$13
  Top 0.254: J1.5 59.08,58.26 63.08,58.26 64.19,57.15 64.19,55.09 59.91,50.8 52.45,50.8 50.86,49.21 50.86,40.16 49.11,38.42 45.42,38.42 D3.4
N$14
  Top 0.254: R26.1 37.85,24.13 38,24.13 38.63,24.77 IC4.6 43.71,24.77 44.67,25.72 44.67,27.62 44.19,28.1 43.55,28.1 43.08,28.57 43.08,29.37 43.55,29.84 | D3.6 43.55,34.65 43.55,29.84 | IC4.13 43.55,29.84
N$15  (via drill 0.5)
  Top 0.254: IC3.6 75.94,37.47 75.78,37.31 75.78,37.15 | 75.78,37.15 v75.78,36.2 | C23.1 75.78,37.15 | C8.+ v68.64,48.26
  Bottom 0.254: v68.64,48.26 68.64,43.34 v75.78,36.2
N$21
  Top 0.254: J1.3 58.92,55.56 48.01,55.56 45.15,52.7 45.14,52.7 44.67,52.24 R15.1 | R15.1 | IC2.8 45.3,47.15 44.67,47.78 R16.1 R15.1
N$22
  Top 0.254: R14.1 44.67,45.25 45.3,45.88 IC2.7 47.84,45.88 48.16,46.2 48.16,47.78 47.52,48.42 R16.2 46.09,50.95 46.09,53.02 48.16,55.09 55.33,55.09 J1.6
N$33
  Top 0.254: J3.3 28.95,55.24 29.9,54.29 R3.1 33.39,52.22 D2.3
N$35
  Top 0.254: IC8.20 81.03,13.03 | 81.02,13.02 Q1.2 85.65,13.02 C22.2
  Top 0.305: 81.03,13.03 81.02,13.02
N$36
  Top 0.254: IC8.19 80.53,15.7 77.84,13.02 Q1.1 69.09,13.02 C21.2
N$40
  Top 2.54: SCREW1.P$1 2.6,63.82 2.6,7.3 SCREW3.P$1 21.33,5.08
  pour Top: 16.57,14.92 20.06,14.92 20.7,14.29 20.7,7.94 23.55,7.94 23.55,14.92 21.01,17.46 16.57,17.46
  pour Top (isolate 0.406): 47.52,5.4 47.52,2.86 20.7,2.86 20.7,7.94 35.3,7.94 35.3,5.4
  pour Route15 (isolate 0.406): 47.68,5.4 47.68,2.86 20.7,2.86 20.7,7.94 35.3,7.94 35.3,5.4
N$44
  Top 0.254: IC5.1 61.17,13.82 R30.2
N$57
  Top 0.254: IC10.11 47.68,14.61 48.16,15.08 48.16,18.1 49.11,19.05 50.38,19.05 53.08,21.75 IC5.21
N$59
  Top 0.254: J2.3 18.79,55.24 21.81,52.22 R2.1 26.73,52.22 D1.3
N$60
  Top 0.254: IC5.23 50.54,16.83 C16.2
N$63
  Top 0.254: R29.2 LED2.C
N$64
  Top 0.254: SP1.2 85.37,6.1 88.96,9.68 R31.2
N$65
  Top 0.254: LED1.C R1.2
N$66
  Top 0.254: IC10.8 45.46,10.79 44.83,11.43 44.83,15.24 45.46,15.88 IC10.12
N$67
  Bottom 0.61: J3.2 26.41,55.24 24.5,53.34 20.06,53.34 | 20.06,53.34 18.16,53.34 16.25,55.24 J2.2 | IC7.6 20.06,32.38 20.06,53.34
N$68
  Top 0.254: IC10.3 42.92,15.88 44.19,17.14 IC10.13
OUT0
  Top 0.254: SV100.27 41.81,9.37 61.65,9.37 62.61,10.32 62.61,14.92 IC5.2
OUT1  (via drill 0.5)
  Top 0.254: IC2.3 39.27,44.61 38.63,43.97 38.63,41.27 v37.68,40.32
  Bottom 0.254: SV100.23 44.19,8.57 34.82,17.94 34.82,38.1 37.05,40.32 v37.68,40.32
OUTINT  (via drill 0.5)
  Top 0.254: IC8.43 83.92,27.9 v83.4,28.42
  Bottom 0.254: IC5.4 61.65,20.95 75.94,20.95 v83.4,28.42
PON  (via drill 0.5)
  Top 0.254: IC6.2 6.73,27.03 v6.73,25.4 | v35.62,25.4 v25.62,25.4 | IC8.93 63.28,22.9 v62.92,22.54 62.92,20.64 R23.2
  Bottom 0.254: v6.73,25.4 v25.62,25.4 | v62.92,22.54 61.97,23.5 52.13,23.5 43.55,32.07 42.28,32.07 v35.62,25.4
RD  (via drill 0.5)
  Top 0.254: IC8.70 74.03,32.23 74.67,31.59 v74.67,27.3 | IC10.10 47.84,13.34 48.63,14.13 48.63,17.94 49.27,18.57 50.54,18.57 52.6,20.64 v56.41,20.64
  Bottom 0.254: v74.67,27.3 68.95,21.59 62.45,21.59 61.18,22.86 58.64,22.86 v56.41,20.64
RES_012
  Top 0.254: R10.1 58.8,43.66 58.8,41.59 IC5.11 61.97,38.42 61.97,30.96 64.53,28.4 IC8.82
RES_UP  (via drill 0.5)
  Top 0.254: IC8.48 86.66,30.4 v86.73,30.32
  Bottom 0.254: v86.73,30.32 86.89,30.32 CON2.10
RESETIN  (via drill 0.5)
  Top 0.254: R34.1 38.79,27.3 IC4.4 v43.87,27.3
  Bottom 0.254: SV100.17 49.43,9.05 45.62,9.05 42.6,12.06 42.6,26.04 v43.87,27.3
RESETOUT  (via drill 0.5)
  Top 0.254: IC4.1 v42.76,31.11 | IC8.3 72.53,16.59 72.13,16.19 71.02,16.19 v70.7,16.51
  Bottom 0.254: v42.76,31.11 44.67,29.21 44.67,25.72 43.55,24.61 43.55,18.57 46.41,15.72 61.34,15.72 63.08,17.46 69.75,17.46 v70.7,16.51
RX_N
  Top 0.254: IC3.22 78.23,42.32 R19.2 76.57,44.13 77.84,45.4 77.84,49.85 T1.6
RX_P
  Top 0.254: IC3.23 77.72,42.04 77.05,42.7 75.62,42.7 75.31,43.02 75.31,45.09 R18.2 77.37,47.16 77.37,49.69 76.89,50.16 76.1,50.16 75.62,50.64 75.62,51.59 76.1,52.07 78.64,52.07 80.23,53.66 T1.3
SCL  (via drill 0.5)
  Top 0.254: IC9.9 15.36,11.68 14.66,12.38 14.66,16.51 16.57,18.41 21.65,18.41 23.08,19.84 23.08,28.73 25.62,31.27 33.87,31.27 35.46,32.86 35.46,44.45 36.25,45.24 v36.25,46.35 | R6.1 J4.4 | IC8.69 74.53,34.75 v74.19,35.08
  Bottom 0.254: J4.4 41.65,55.24 40.06,53.66 38.16,53.66 35.78,51.28 35.78,46.83 v36.25,46.35 36.73,45.88 61.81,45.88 65.14,42.55 65.14,35.88 65.78,35.24 74.03,35.24 v74.19,35.08
SDA  (via drill 0.5)
  Top 0.254: IC9.8 13.49,11.68 14.19,12.38 14.19,16.67 16.41,18.89 21.49,18.89 22.6,20 22.6,28.89 25.46,31.75 33.71,31.75 34.98,33.02 34.98,45.09 v35.3,45.4 | R5.1 J4.3 | IC8.67 75.53,34.83 v75.78,35.08
  Bottom 0.254: J4.3 39.11,55.24 35.3,51.44 v35.3,45.4 61.65,45.4 64.67,42.39 64.67,35.72 65.62,34.77 73.4,34.77 73.88,34.29 74.99,34.29 v75.78,35.08
SPEAKER
  Top 0.254: IC8.28 86.18,20.4 86.89,19.68 86.89,15.88 88.48,14.29 88.48,14.28 R31.1
SWCLK  (via drill 0.5)
  Top 0.254: IC8.24 83.03,16.19 v83.08,16.19
  Bottom 0.254: v83.08,16.19 83.08,16.67 86.42,20 86.42,21.91 88.64,24.13 CON2.4
SWDIO  (via drill 0.5)
  Top 0.254: IC8.25 83.53,16.86 v84.19,16.19
  Bottom 0.254: v84.19,16.19 84.19,17.14 86.89,19.84 86.89,21.75 88,22.86 CON2.2
SWO  (via drill 0.5)
  Top 0.254: IC8.23 82.53,16.75 v81.97,16.19
  Bottom 0.254: v81.97,16.19 85.94,20.16 85.94,22.07 CON2.6
TEST
  Top 0.254: SV100.11 61.18,8.41 61.97,8.41 63.56,10 63.56,14.45 64.35,15.24 72.45,15.24 73.53,16.32 IC8.5
TX_N
  Top 0.254: IC3.20 79.24,42.2 79.75,42.7 81.02,42.7 81.34,43.02 81.34,45.09 R20.2 81.66,47.94 T1.2
TX_P
  Top 0.254: IC3.21 78.73,42.48 79.43,43.18 79.43,43.33 R21.2 80.07,44.14 78.8,45.41 78.8,47.31 79.11,47.62 80.7,47.62 81.18,48.1 81.18,50.16 80.7,50.64 80.7,51.59 82.77,53.66 T1.1
VCC  (via drill 0.5)
  Top 0.254: CON1.2 9.9,52.39 8.78,53.51 LED1.A | C19.1 v18.16,9.53 19.43,10.79 19.43,12.38 | IC9.12 19.12,13.64 19.43,13.34 19.43,12.38 | IC9.10 19.39,12.34 19.43,12.38 | R6.2 R5.2 38.63,48.9 v38.63,47.62 | C12.1 v46.73,33.66 46.73,31.22 IC4.14 | R3.2 28.48,50.8 24.97,50.8 R2.2 23.39,49.21 v21.65,49.21 | C16.1 50.54,14.29 IC5.24 53.08,11.27 C20.1 | D4.5 v38.79,36.83 37.36,35.4 R35.2 | D3.5 44.19,36.83 v43.55,37.47 | R14.2 v49.11,40.96 | R26.2 v37.36,19.05 | R28.2 v49.75,27.3 | R32.2 49.59,20.95 v48,20.95
  Top 0.61: 15.93,41.91 15.93,40.64 | v27.68,42.55 C2.1 | v27.68,42.55 27.66,42.52 IC1.3 | C1.+ 27.68,44.05 v27.68,42.55
  Top 3.81: CON1.2 15.93,41.91 15.93,25.4 IC6.6
  pour Route15 (isolate 0.305, rank 2): 0.06,0 95.94,0 95.94,71.12 47.6,71.12 47.6,61.28 10.22,61.28 10.22,71.12 0.06,71.12
VCCINT  (via drill 0.5)
  Top 0.254: 8.78,16.83 8.63,16.83 | IC2.1 41.97,47.15 42.57,46.54 C4.1 42.57,39.24 v42.6,39.21 | v48,33.66 49.75,33.66 R24.2 | R34.2 35.94,30.16 35.94,35.88 v36.41,36.35
  Route15 0.61: IC7.2 24.5,17.78 | 24.5,17.78 v12.44,17.78 | v42.6,39.21 42.6,35.24 | 42.6,35.24 46.41,35.24 v48,33.66 | 42.6,35.24 37.52,35.24 v36.41,36.35 28.63,36.35 24.5,32.23 24.5,17.78
  pour Top: 13.39,14.92 9.9,14.92 4.82,20 4.82,22.54 8.63,22.54 8.63,20.32 10.22,18.73 13.39,18.73
VCCIO  (via drill 0.5)
  Top 0.254: IC3.1 74.35,40.01 74.35,40.32 | C9.1 82.32,41.59 v80.54,41.59 79.75,40.8 IC3.19 | R18.1 R19.1 v73.72,48.1 | R21.1 R20.1 82.92,46.36 v82.92,48.1 | C10.2 v85.15,48.1 | C5.+ v66.1,41.91 L1.2 | 74.35,40.32 74.35,41.12 v75.78,41.12 | C7.1 74.16,40.51 74.35,40.32
  pour Route15 (isolate 0.305): 65.14,38.73 65.14,54.77 86.58,54.77 86.58,38.73
VDD  (via drill 0.5)
  Top 0.254: R4.2 v36.57,47.62 | C15.1 v46.73,20.95 46.73,18.41 IC10.14 | 30.54,35.16 30.73,34.97 C11.1 | R7.2 R8.2 R9.2 R10.2 v62.45,48.42 | IC8.21 81.53,19.68 v81.34,19.68 | IC8.9 75.53,19.27 v75.94,19.68 76.03,19.6 | IC8.10 76.03,19.6 | IC8.11 76.53,19.1 76.03,19.6 | IC8.31 83.88,21.9 83.38,22.4 | IC8.32 83.38,22.4 | 83.38,22.4 v83.24,22.54 83.6,22.9 IC8.33 | IC8.1 71.53,19.68 v71.5,19.68 71.28,19.9 IC8.99 68.06,19.9 67.53,19.37 67.5,19.37 C17.1 | IC3.9 78.23,35.15 v78.16,35.08 | v69.59,33.18 67.69,33.18 67.56,33.31 C13.1 | v69.59,33.18 71.53,33.18 IC8.75 | IC8.76 69.59,31.4 v69.59,33.18 | IC8.45 v86.73,28.9 v86.73,28.89 | IC8.54 82.03,31.8 v81.81,31.59 | v91.34,37.62 91.34,35.91 C14.1 91.33,35.85 R25.1 | v91.34,15.72 91.34,17.46 C18.1 | IC8.50 85.38,31.98 85.94,32.54 v86.42,32.54 | C6.1 v68.64,36.04 | L1.1 v66.1,36.04
  Top 0.61: C3.+ 30.54,38.19 | 30.54,38.19 v30.54,40.32 | 30.54,38.19 30.54,37.47 | 30.54,37.47 30.54,35.24 30.73,35.05 C11.1 | IC1.2 27.97,37.47 30.54,37.47 | 30.54,35.16 v30.54,33.02
  Route15 0.254: v36.57,47.62 34.98,47.62 30.54,43.18 v30.54,40.32 | v62.45,48.42 63.24,47.62 63.24,37.78 64.99,36.04 v66.1,36.04
  Route15 0.61: v30.54,33.02 33.39,30.16 46.73,30.16 | 46.73,30.16 47.37,30.8 63.56,30.8 | v46.73,20.95 46.73,30.16
  pour Route15 (isolate 0.305): 63.24,38.1 63.24,9.21 93.72,9.21 93.72,38.1
WR  (via drill 0.5)
  Top 0.254: IC8.26 84.48,19.4 83.4,20.48 80.07,20.48 v79.27,19.68 | IC10.9 47.84,12.06 49.11,13.34 49.11,14.92 49.75,15.56 56.89,15.56 IC5.3
  Bottom 0.254: v79.27,19.68 78.48,18.89 61.18,18.89 IC5.3

### Text on the board
Bottom: STN EB-1